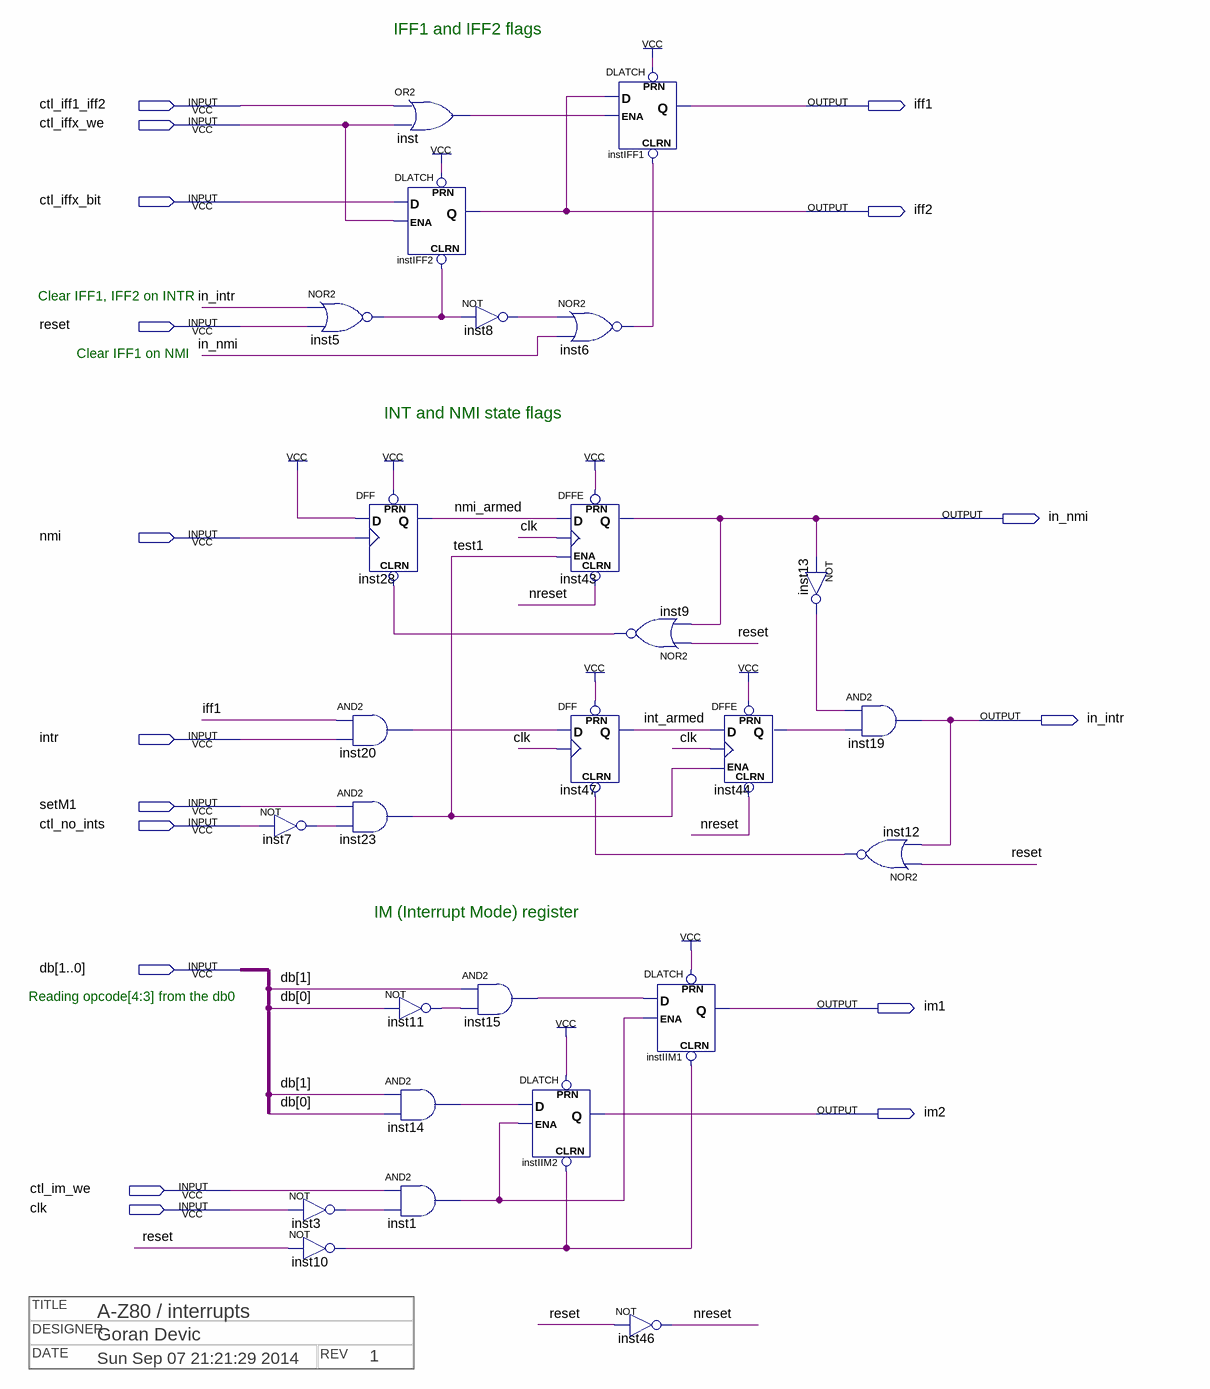
[diagram p0: schematic sheet]
// Quartus schematic interrupts.bdf as structural Verilog: 26 symbols, 17 pins
// Title block: TITLE: A-Z80 / interrupts; DESIGNER: Goran Devic; DATE: Sun Sep 07 21:21:29 2014; REV: 1
module interrupts (
  input  ctl_iff1_iff2,
  input  ctl_iffx_we,
  input  ctl_iffx_bit,
  input  reset,
  input  nmi,
  input  intr,
  input  setM1,
  input  ctl_no_ints,
  input  [1:0] db,
  input  ctl_im_we,
  input  clk,
  output iff1,
  output iff2,
  output in_nmi,
  output in_intr,
  output im1,
  output im2
);

  wire inst1_out, inst3_out, inst5_out, inst6_out, inst7_out, inst8_out, inst9_out, inst10_out, inst11_out,
       inst12_out, inst13_out, inst14_out, inst15_out, inst20_out, inst44_q, inst_out, int_armed, nmi_armed,
       nreset, test1;

  not inst7 (inst7_out, ctl_no_ints);
  nor inst5 (inst5_out, in_intr, reset);
  DFF inst28 (.CLRN(inst9_out), .CLK(nmi), .D(1'b1), .PRN(1'b1), .Q(nmi_armed));
  and inst20 (inst20_out, iff1, intr);
  and inst23 (test1, setM1, inst7_out);
  not inst3 (inst3_out, clk);
  not inst10 (inst10_out, reset);
  or inst (inst_out, ctl_iff1_iff2, ctl_iffx_we);
  DLATCH instIFF2 (.CLRN(inst5_out), .D(ctl_iffx_bit), .ENA(ctl_iffx_we), .PRN(1'b1), .Q(iff2));
  not inst11 (inst11_out, db[0]);
  and inst14 (inst14_out, db[1], db[0]);
  and inst1 (inst1_out, ctl_im_we, inst3_out);
  not inst8 (inst8_out, inst5_out);
  and inst15 (inst15_out, db[1], inst11_out);
  nor inst6 (inst6_out, inst8_out, in_nmi);
  DFFE inst43 (.PRN(1'b1), .CLRN(nreset), .D(nmi_armed), .CLK(clk), .ENA(test1), .Q(in_nmi));
  DFF inst47 (.CLRN(inst12_out), .CLK(clk), .D(inst20_out), .PRN(1'b1), .Q(int_armed));
  DLATCH instIIM2 (.CLRN(inst10_out), .D(inst14_out), .ENA(inst1_out), .PRN(1'b1), .Q(im2));
  DLATCH instIFF1 (.CLRN(inst6_out), .D(iff2), .ENA(inst_out), .PRN(1'b1), .Q(iff1));
  nor inst9 (inst9_out, reset, in_nmi);
  DLATCH instIIM1 (.CLRN(inst10_out), .D(inst15_out), .ENA(inst1_out), .PRN(1'b1), .Q(im1));
  not inst46 (nreset, reset);
  DFFE inst44 (.PRN(1'b1), .CLRN(nreset), .D(int_armed), .CLK(clk), .ENA(test1), .Q(inst44_q));
  not inst13 (inst13_out, in_nmi);
  and inst19 (in_intr, inst13_out, inst44_q);
  nor inst12 (inst12_out, reset, in_intr);

  // Notes on the sheet:
  //   IFF1 and IFF2 flags
  //   Clear IFF1, IFF2 on INTR
  //   Clear IFF1 on NMI
  //   INT and NMI state flags
  //   IM (Interrupt Mode) register
  //   Reading opcode[4:3] from the db0
endmodule
